# Altium schematic sheet Sheet2.SchDoc
size 420 x 297 mm
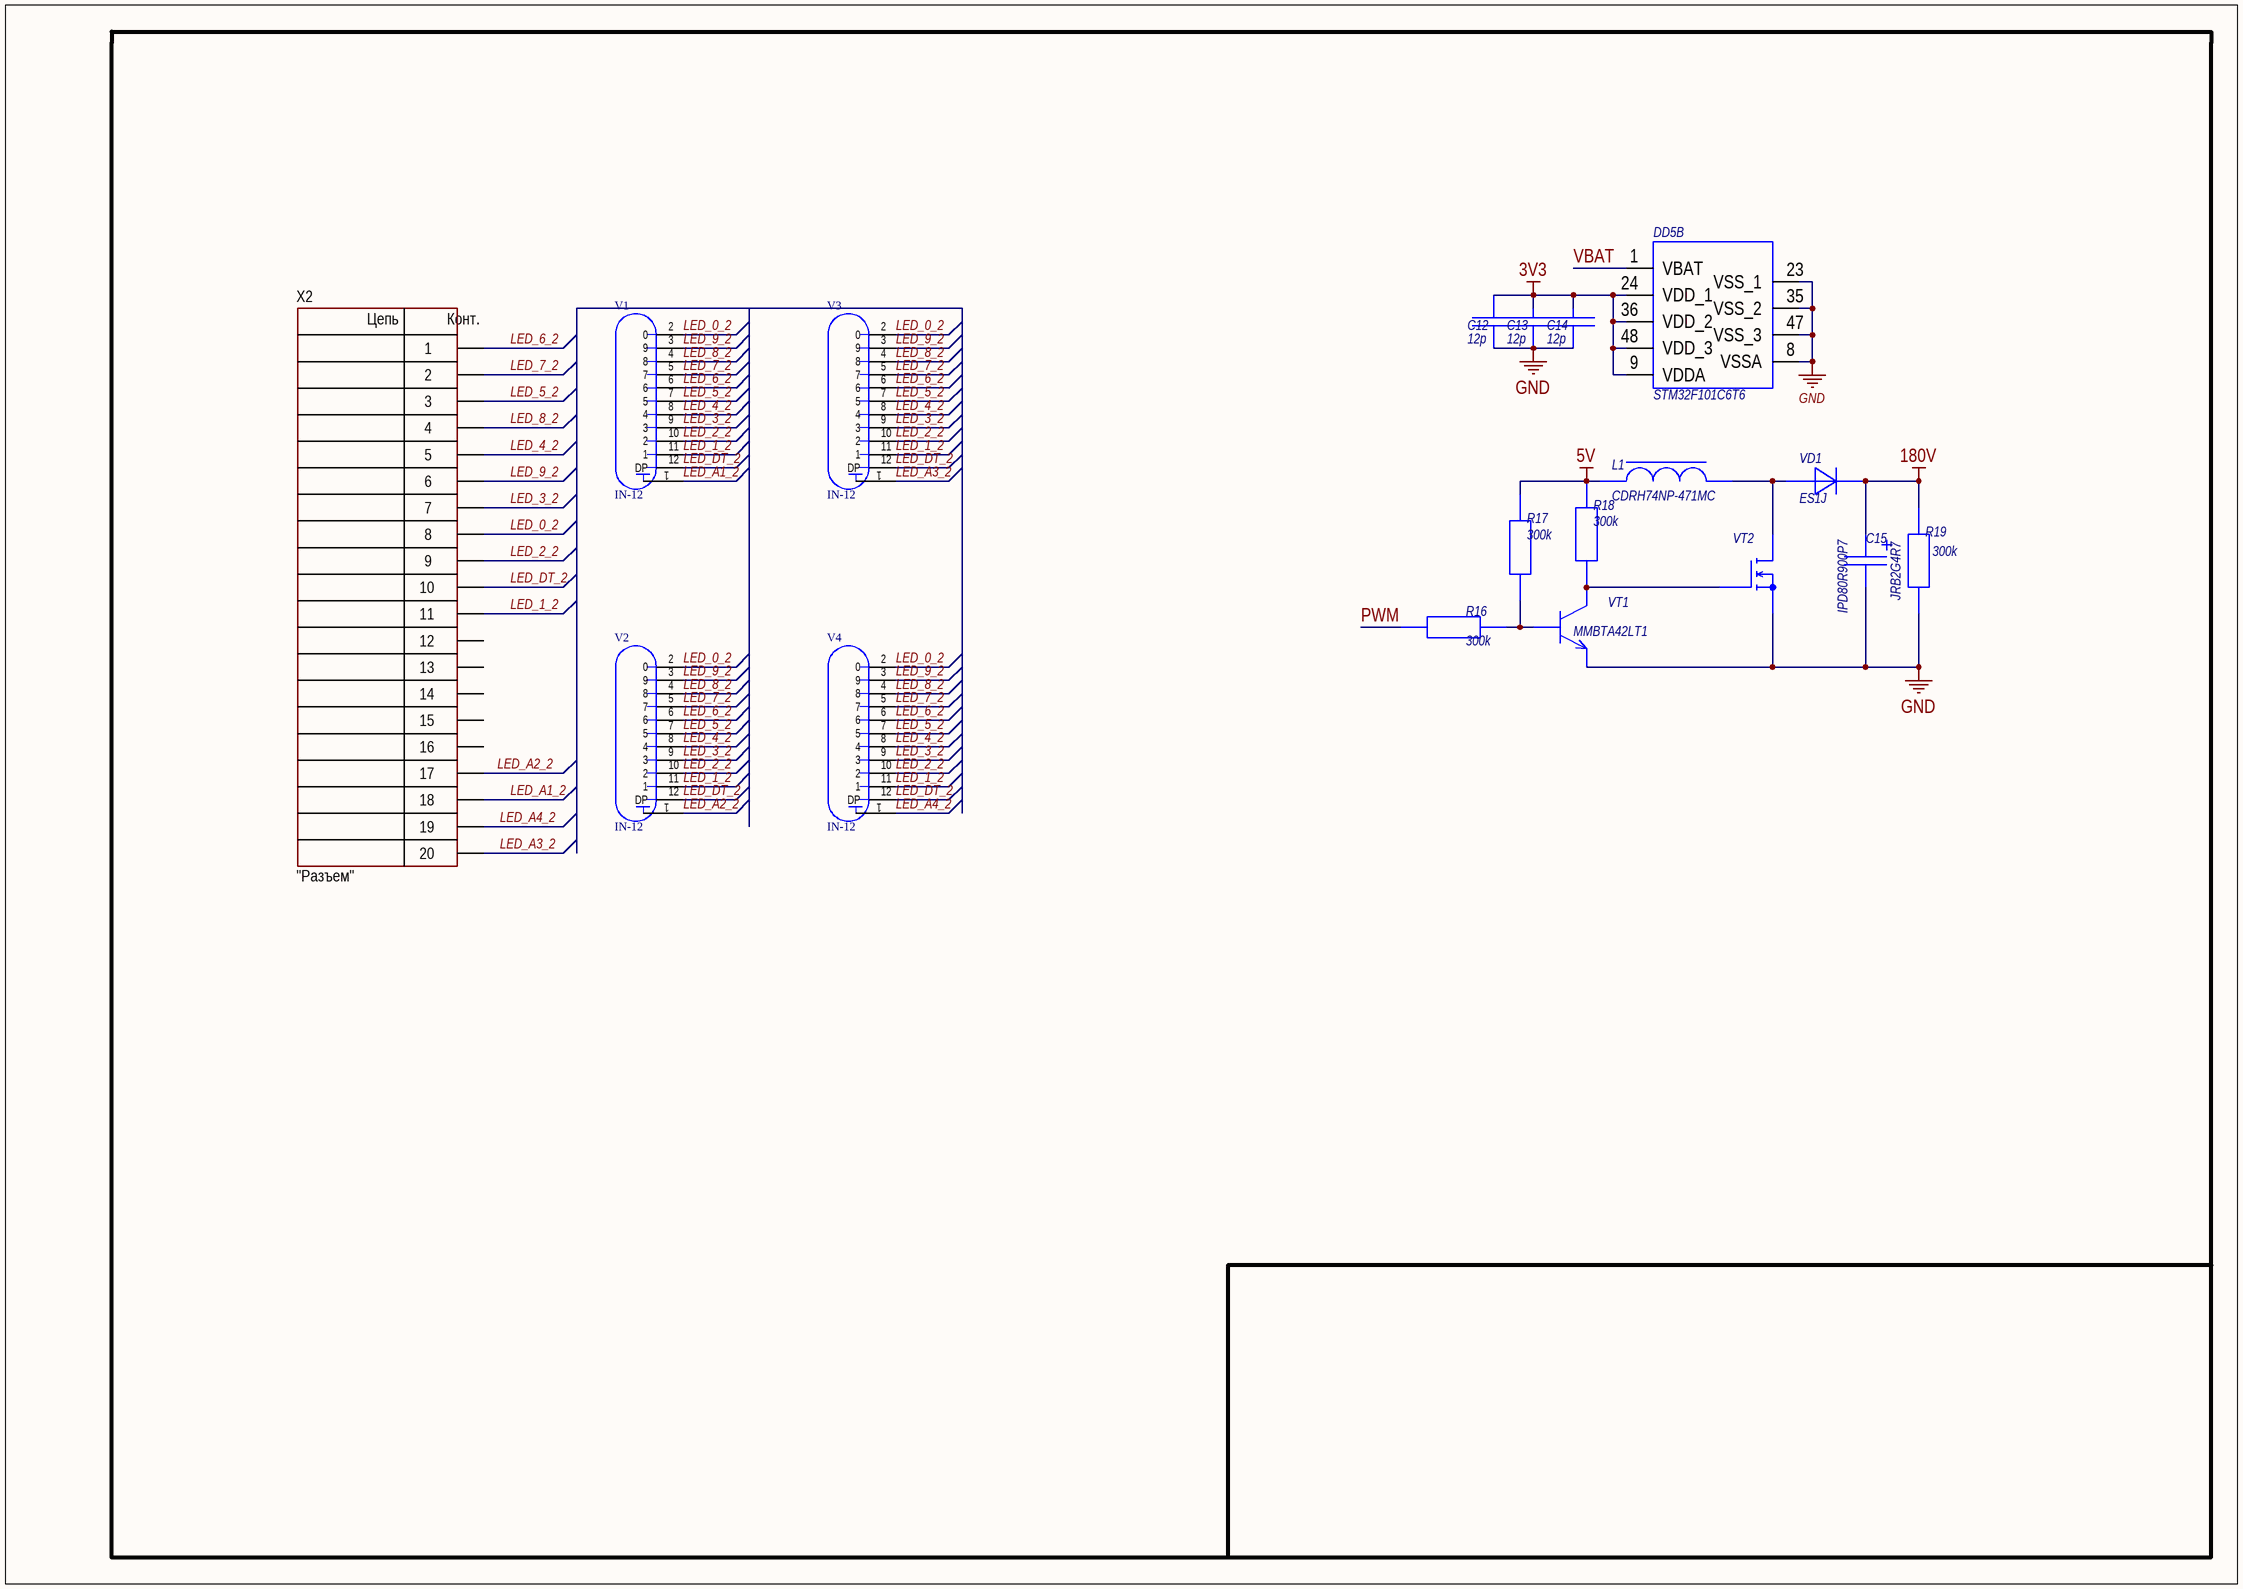
[diagram p0: Sheet2.SchDoc]

## Parts
C12  12p  [CAPACITOR 0603]
C13  12p  [CAPACITOR 0603]
C14  12p  [CAPACITOR 0603]
C15  JRB2G4R7  [CAPASITOR R10]
DD5  STM32F101C6T6  [48-LQFP]  (part B of 2)
L1  CDRH74NP-471MC  [SRR0603B]
R16  300k  [RESISTOR 0603]
R17  300k  [RESISTOR 0603]
R18  300k  [RESISTOR 0603]
R19  300k  [RESISTOR 0805]
V1  IN-12  [DIODE: IN-12]
V2  IN-12  [DIODE: IN-12]
V3  IN-12  [DIODE: IN-12]
V4  IN-12  [DIODE: IN-12]
VD1  ES1J  [DO-214]
VT1  MMBTA42LT1  [SOT-23]
VT2  IPD80R900P7  [DPAK]
X2  CommentText: "Разъем"  [CON: PLD-20-rebro]

## Nets
3V3: C12.2 C13.2 C14.2 DD5.9(VDDA) DD5.24(VDD_1) DD5.36(VDD_2) DD5.48(VDD_3)
5V: L1.1 R17.1 R18.1
180V: C15.1 R19.1 VD1.1(А)
GND: C12.1 C13.1 C14.1 C15.2 DD5.8(VSSA) DD5.23(VSS_1) DD5.35(VSS_2) DD5.47(VSS_3) R19.2 VT1.3(Э) VT2.3(S)
LED_0_2: V1.2(0) V2.2(0) V3.2(0) V4.2(0) X2.8
LED_1_2: V1.11(1) V2.11(1) V3.11(1) V4.11(1) X2.11
LED_2_2: V1.10(2) V2.10(2) V3.10(2) V4.10(2) X2.9
LED_3_2: V1.9(3) V2.9(3) V3.9(3) V4.9(3) X2.7
LED_4_2: V1.8(4) V2.8(4) V3.8(4) V4.8(4) X2.5
LED_5_2: V1.7(5) V2.7(5) V3.7(5) V4.7(5) X2.3
LED_6_2: V1.6 V2.6 V3.6 V4.6 X2.1
LED_7_2: V1.5(7) V2.5(7) V3.5(7) V4.5(7) X2.2
LED_8_2: V1.4(8) V2.4(8) V3.4(8) V4.4(8) X2.4
LED_9_2: V1.3(9) V2.3(9) V3.3(9) V4.3(9) X2.6
LED_A1_2: V1.1(A) X2.18
LED_A2_2: V2.1(A) X2.17
LED_A3_2: V3.1(A) X2.20
LED_A4_2: V4.1(A) X2.19
LED_DT_2: V1.12(DP) V2.12(DP) V3.12(DP) V4.12(DP) X2.10
PWM: R16.2
VBAT: DD5.1(VBAT)
NetL1_2: L1.2 VD1.2(К) VT2.2(D)
NetR16_1: R16.1 R17.2 VT1.1(Б)
NetR18_2: R18.2 VT1.2(К) VT2.1(G)

Not connected (* = marked no-connect by the designer): X2 12 13 14 15 16

## Notes on the sheet
- (in symbol PLD-20-REBRO) Цепь; Конт.

## Library data of the parts
C12-C14 = SMD-CAP: Capacitor
C15 = TC-D: Value: {Value}
DD5 = STM32F103C8T6: Controller
L1 = Inductor
R16-R19 = SMD-RES_1: Resistor
V1-V4 = IN-12: Vacuum Indicator; Published: 8-Jun-2000; LatestRevisionDate: 17-Jul-2002; LatestRevisionNote: Re-released for DXP Platform.; PackageReference: VTUBE-9; Publisher: Altium Limited; PackageDescription: Vacuum Tube; 9 Leads
VD1 = D-Diod: Diod
VT1 = Transistor-NPN: Transistor; Обозначение для заказа: IRLML2502TRPBF
VT2 = Channel-N: Transistor; Обозначение для заказа: IRLML2502TRPBF
X2 = PLD-20-REBRO: Manufacturer: Connfly; ValueManufacturerPartNumber: Connector, 20pin, 2.54mm, 500VAC, 3A; PartNumber: PLD-20; TypeConnector: Connector; VoltageMax: 500VAC; Pitch: 2.54mm; CurrentMax: 3A; Multichannel: 20pin; HelpURL: https://www.chipdip.ru/product/pld-20